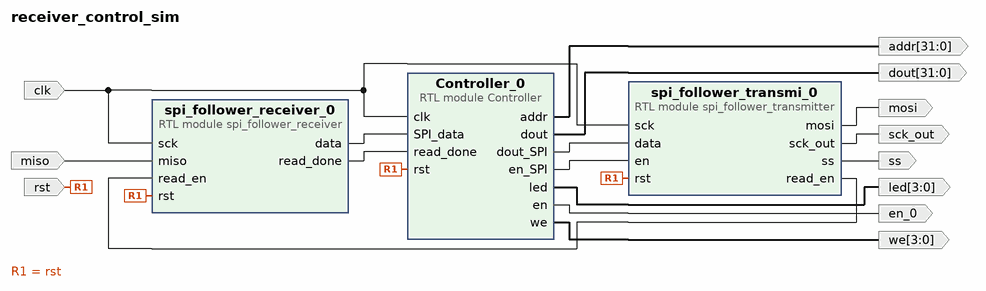
[diagram p0: block diagram of the top level]
# Vivado block design receiver_control_sim, xc7z020clg400-1, Vivado 2020.1
create_bd_design receiver_control_sim

create_bd_port -dir I -type clk clk
create_bd_port -dir I -type rst rst
create_bd_port -dir O mosi
create_bd_port -dir O -from 31 -to 0 addr
create_bd_port -dir O -from 31 -to 0 dout
create_bd_port -dir O -from 3 -to 0 led
create_bd_port -dir O -from 3 -to 0 we
create_bd_port -dir O sck_out
create_bd_port -dir O ss
create_bd_port -dir I miso
create_bd_port -dir O en_0

create_bd_cell -type module -reference spi_follower_receiver spi_follower_receiver_0
create_bd_cell -type module -reference spi_follower_transmitter spi_follower_transmi_0
create_bd_cell -type module -reference Controller Controller_0

# ---- connections ----

connect_bd_net -net clk_0_1 [get_bd_ports clk] \
  [get_bd_pins spi_follower_receiver_0/sck] [get_bd_pins spi_follower_transmi_0/sck] [get_bd_pins Controller_0/clk]
connect_bd_net -net rst_0_1 [get_bd_ports rst] \
  [get_bd_pins spi_follower_receiver_0/rst] [get_bd_pins spi_follower_transmi_0/rst] [get_bd_pins Controller_0/rst]
connect_bd_net [get_bd_pins spi_follower_transmi_0/mosi] [get_bd_ports mosi]
connect_bd_net [get_bd_pins spi_follower_receiver_0/data] [get_bd_pins Controller_0/SPI_data]
connect_bd_net [get_bd_pins spi_follower_receiver_0/read_done] [get_bd_pins Controller_0/read_done]
connect_bd_net [get_bd_pins Controller_0/dout_SPI] [get_bd_pins spi_follower_transmi_0/data]
connect_bd_net [get_bd_pins spi_follower_transmi_0/read_en] [get_bd_pins spi_follower_receiver_0/read_en]
connect_bd_net [get_bd_pins Controller_0/addr] [get_bd_ports addr]
connect_bd_net [get_bd_pins Controller_0/dout] [get_bd_ports dout]
connect_bd_net [get_bd_pins Controller_0/led] [get_bd_ports led]
connect_bd_net [get_bd_pins Controller_0/we] [get_bd_ports we]
connect_bd_net [get_bd_pins spi_follower_transmi_0/sck_out] [get_bd_ports sck_out]
connect_bd_net [get_bd_pins spi_follower_transmi_0/ss] [get_bd_ports ss]
connect_bd_net -net miso_0_1 [get_bd_ports miso] [get_bd_pins spi_follower_receiver_0/miso]
connect_bd_net [get_bd_pins Controller_0/en] [get_bd_ports en_0]
connect_bd_net [get_bd_pins Controller_0/en_SPI] [get_bd_pins spi_follower_transmi_0/en]

validate_bd_design
save_bd_design
